# EAGLE design left (EAGLE 9.6.2)
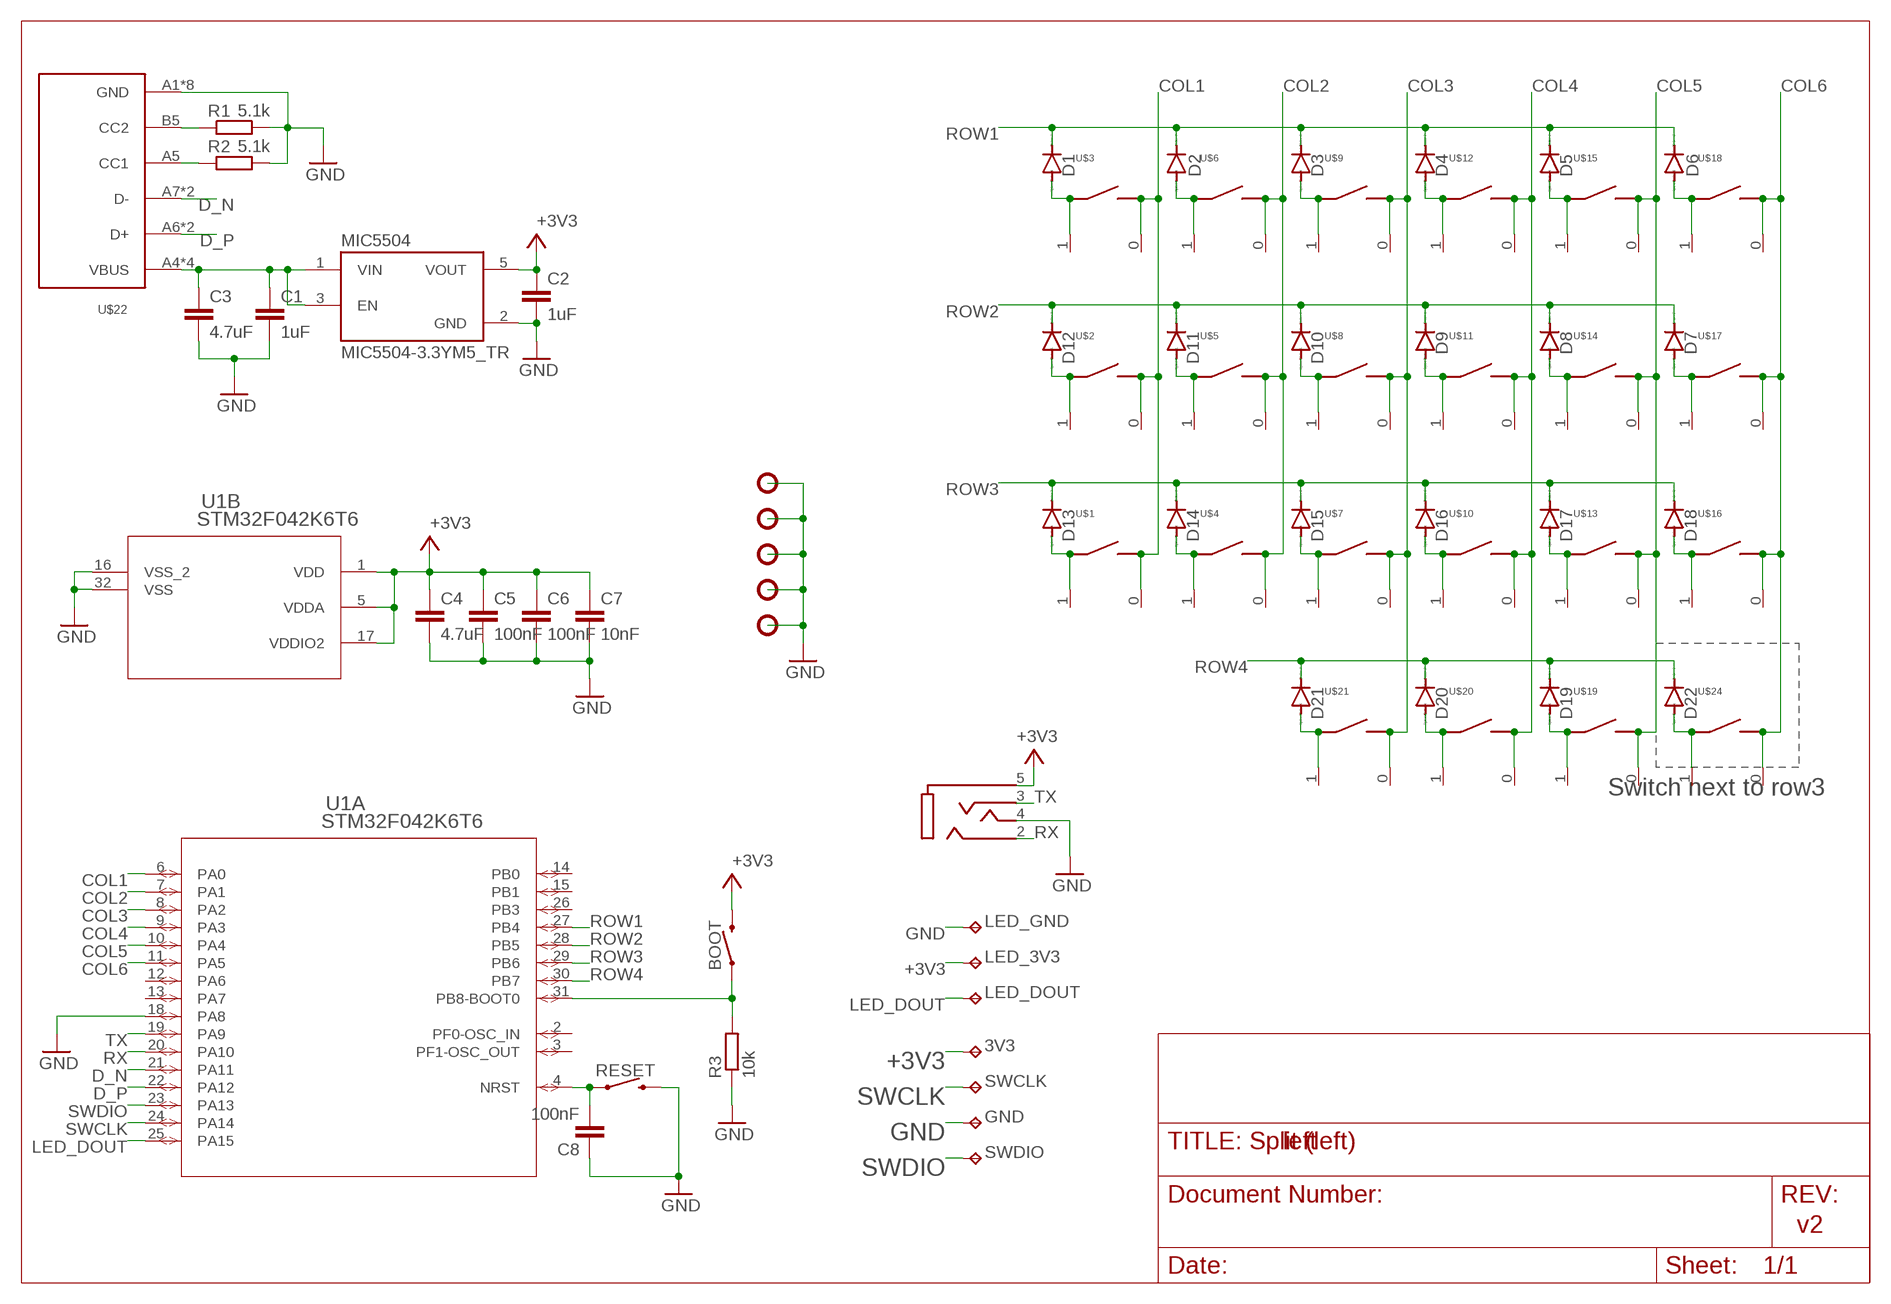
[diagram p0: schematic, sheet 1]

## Parts
3V3  TPTP20R  [TP20R]
BOOT  MOMENTARY-SWITCH-SPST-SMD-6.2MM-TALL  [TACTILE_SWITCH_SMD_6.2MM]
C1  1uF  C-EUC0603  [C0603]
C2  1uF  C-EUC0603  [C0603]
C3  4.7uF  C-EUC0603  [C0603]
C4  4.7uF  C-EUC0603  [C0603]
C5  100nF  C-EUC0603  [C0603]
C6  100nF  C-EUC0603  [C0603]
C7  10nF  C-EUC0603  [C0603]
C8  100nF  C-EUC0603  [C0603]
D1  DIODE-MINIMELF  [MINIMELF]
D2  DIODE-MINIMELF  [MINIMELF]
D3  DIODE-MINIMELF  [MINIMELF]
D4  DIODE-MINIMELF  [MINIMELF]
D5  DIODE-MINIMELF  [MINIMELF]
D6  DIODE-MINIMELF  [MINIMELF]
D7  DIODE-MINIMELF  [MINIMELF]
D8  DIODE-MINIMELF  [MINIMELF]
D9  DIODE-MINIMELF  [MINIMELF]
D10  DIODE-MINIMELF  [MINIMELF]
D11  DIODE-MINIMELF  [MINIMELF]
D12  DIODE-MINIMELF  [MINIMELF]
D13  DIODE-MINIMELF  [MINIMELF]
D14  DIODE-MINIMELF  [MINIMELF]
D15  DIODE-MINIMELF  [MINIMELF]
D16  DIODE-MINIMELF  [MINIMELF]
D17  DIODE-MINIMELF  [MINIMELF]
D18  DIODE-MINIMELF  [MINIMELF]
D19  DIODE-MINIMELF  [MINIMELF]
D20  DIODE-MINIMELF  [MINIMELF]
D21  DIODE-MINIMELF  [MINIMELF]
D22  DIODE-MINIMELF  [MINIMELF]
GND  TPTP20R  [TP20R]
LED_3V3  TPTP20R  [TP20R]
LED_DOUT  TPTP20R  [TP20R]
LED_GND  TPTP20R  [TP20R]
MIC5504  MIC5504-3.3YM5_TR  [SOT95P280X145-5N]
R1  5.1k  R-EU_R0603  [R0603]
R2  5.1k  R-EU_R0603  [R0603]
R3  10k  R-EU_R0603  [R0603]
RESET  MOMENTARY-SWITCH-SPST-SMD-6.2MM-TALL  [TACTILE_SWITCH_SMD_6.2MM]
SWCLK  TPTP20R  [TP20R]
SWDIO  TPTP20R  [TP20R]
U1  STM32F042K6T6  [LQFP-32]
U$1  CHOC-CHOC-1U  [CHOC-1U]
U$2  CHOC-CHOC-1U  [CHOC-1U]
U$3  CHOC-CHOC-1U  [CHOC-1U]
U$4  CHOC-CHOC-1U  [CHOC-1U]
U$5  CHOC-CHOC-1U  [CHOC-1U]
U$6  CHOC-CHOC-1U  [CHOC-1U]
U$7  CHOC-CHOC-1U  [CHOC-1U]
U$8  CHOC-CHOC-1U  [CHOC-1U]
U$9  CHOC-CHOC-1U  [CHOC-1U]
U$10  CHOC-CHOC-1U  [CHOC-1U]
U$11  CHOC-CHOC-1U  [CHOC-1U]
U$12  CHOC-CHOC-1U  [CHOC-1U]
U$13  CHOC-CHOC-1U  [CHOC-1U]
U$14  CHOC-CHOC-1U  [CHOC-1U]
U$15  CHOC-CHOC-1U  [CHOC-1U]
U$16  CHOC-CHOC-1U  [CHOC-1U]
U$17  CHOC-CHOC-1U  [CHOC-1U]
U$18  CHOC-CHOC-1U  [CHOC-1U]
U$19  CHOC-CHOC-1U  [CHOC-1U]
U$20  CHOC-CHOC-1U  [CHOC-1U]
U$21  CHOC-CHOC-1U  [CHOC-1U]
U$22  217B-AG01  [217B-AG01]
U$23  PJ320A  [PJ320A]
U$24  CHOC-CHOC-1U  [CHOC-1U]
U$25  SOCKET  [CHOC-SOCKET]
U$26  SOCKET  [CHOC-SOCKET]
U$27  SOCKET  [CHOC-SOCKET]
U$28  SOCKET  [CHOC-SOCKET]
U$29  SOCKET  [CHOC-SOCKET]
U$30  SOCKET  [CHOC-SOCKET]
U$31  SOCKET  [CHOC-SOCKET]
U$32  SOCKET  [CHOC-SOCKET]
U$33  SOCKET  [CHOC-SOCKET]
U$34  SOCKET  [CHOC-SOCKET]
U$35  SOCKET  [CHOC-SOCKET]
U$36  SOCKET  [CHOC-SOCKET]
U$37  SOCKET  [CHOC-SOCKET]
U$38  SOCKET  [CHOC-SOCKET]
U$39  SOCKET  [CHOC-SOCKET]
U$40  SOCKET  [CHOC-SOCKET]
U$41  SOCKET  [CHOC-SOCKET]
U$42  SOCKET  [CHOC-SOCKET]
U$43  SOCKET  [CHOC-SOCKET]
U$44  SOCKET  [CHOC-SOCKET]
U$45  SOCKET  [CHOC-SOCKET]
U$46  SOCKET  [CHOC-SOCKET]
U$47  MOUNTING-PADHOLE-M2-OFFSET  [HOLE-M2-OFFSET]
U$48  MOUNTING-PADHOLE-M2-OFFSET  [HOLE-M2-OFFSET]
U$49  MOUNTING-PADHOLE-M2-OFFSET  [HOLE-M2-OFFSET]
U$50  MOUNTING-PADHOLE-M2-OFFSET  [HOLE-M2-OFFSET]
U$51  MOUNTING-PADHOLE-M2-OFFSET  [HOLE-M2-OFFSET]

## Nets
+3V3: 3V3.TP BOOT.B2 C2.1 C4.1 C5.1 C6.1 C7.1 LED_3V3.TP MIC5504.5(VOUT) U1.1(B:VDD) U1.5(B:VDDA) U1.17(B:VDDIO2) U$23.5
COL1: U1.6(A:PA0) U$1.1 U$2.1 U$3.1 U$25.0 U$30.0 U$41.0
COL2: U1.7(A:PA1) U$4.1 U$5.1 U$6.1 U$26.0 U$31.0 U$42.0
COL3: U1.8(A:PA2) U$7.1 U$8.1 U$9.1 U$21.1 U$27.0 U$32.0 U$37.0 U$43.0
COL4: U1.9(A:PA3) U$10.1 U$11.1 U$12.1 U$20.1 U$28.0 U$33.0 U$38.0 U$44.0
COL5: U1.10(A:PA4) U$13.1 U$14.1 U$15.1 U$19.1 U$29.0 U$34.0 U$39.0 U$45.0
COL6: U1.11(A:PA5) U$16.1 U$17.1 U$18.1 U$24.1 U$35.0 U$36.0 U$40.0 U$46.0
D_N: U1.21(A:PA11) U$22.A7(D-) U$22.B7(D-)
D_P: U1.22(A:PA12) U$22.A6(D+) U$22.B6(D+)
GND: C1.2 C2.2 C3.2 C4.2 C5.2 C6.2 C7.2 C8.1 GND.TP LED_GND.TP MIC5504.2(GND) R1.2 R2.2 R3.1 RESET.B2 U1.16(B:VSS_2) U1.18(A:PA8) U1.32(B:VSS) U$22.A1(GND) U$22.A12(GND) U$22.B1(GND) U$22.B12(GND) U$22.SHELL1(GND) U$22.SHELL2(GND) U$22.SHELL3(GND) U$22.SHELL(GND) U$23.4 U$47.P$1(P) U$48.P$1(P) U$49.P$1(P) U$50.P$1(P) U$51.P$1(P)
LED_DOUT: LED_DOUT.TP U1.25(A:PA15)
N$1: R2.1 U$22.A5(CC1)
N$2: R1.1 U$22.B5(CC2)
N$3: C1.1 C3.1 MIC5504.1(VIN) MIC5504.3(EN) U$22.A4(VBUS) U$22.A9(VBUS) U$22.B4(VBUS) U$22.B9(VBUS)
N$4: D1.A U$3.0 U$41.1
N$5: D2.A U$6.0 U$42.1
N$7: D12.A U$2.0 U$30.1
N$8: D11.A U$5.0 U$31.1
N$9: BOOT.A2 R3.2 U1.31(A:PB8-BOOT0)
N$10: C8.2 RESET.A2 U1.4(A:NRST)
N$11: D18.A U$16.0 U$36.1
N$12: D10.A U$8.0 U$32.1
N$13: D9.A U$11.0 U$33.1
N$14: D8.A U$14.0 U$34.1
N$15: D7.A U$17.0 U$35.1
N$16: D22.A U$24.0 U$40.1
N$17: D17.A U$13.0 U$29.1
N$18: D13.A U$1.0 U$25.1
N$19: D14.A U$4.0 U$26.1
N$20: D15.A U$7.0 U$27.1
N$21: D16.A U$10.0 U$28.1
N$22: D20.A U$20.0 U$38.1
N$23: D3.A U$9.0 U$43.1
N$24: D4.A U$12.0 U$44.1
N$25: D5.A U$15.0 U$45.1
N$26: D6.A U$18.0 U$46.1
N$27: D21.A U$21.0 U$37.1
N$28: D19.A U$19.0 U$39.1
ROW1: D1.C D2.C D3.C D4.C D5.C D6.C U1.27(A:PB4)
ROW2: D7.C D8.C D9.C D10.C D11.C D12.C U1.28(A:PB5)
ROW3: D13.C D14.C D15.C D16.C D17.C D18.C U1.29(A:PB6)
ROW4: D19.C D20.C D21.C D22.C U1.30(A:PB7)
RX: U1.20(A:PA10) U$23.2
SWCLK: SWCLK.TP U1.24(A:PA14)
SWDIO: SWDIO.TP U1.23(A:PA13)
TX: U1.19(A:PA9) U$23.3
Unconnected: U1.2(A:PF0-OSC_IN) U1.3(A:PF1-OSC_OUT) U1.12(A:PA6) U1.13(A:PA7) U1.14(A:PB0) U1.15(A:PB1) U1.26(A:PB3)

## Notes on the sheet
- Switch next to row3
- Split (left)
- v2

## Library data of the parts
3V3 GND LED_3V3 LED_DOUT LED_GND SWCLK SWDIO = testpad:TP: Test pad
BOOT RESET = PTS645SH50SMTR92LFS:MOMENTARY-SWITCH-SPST: PTS645SH50SMTR92LFS C&K SPST Pushbutton; PROD_ID: SWCH-11966; SF_SKU: COM-12992
C1-C8 = rcl:C-EU: CAPACITOR, European symbol; SPICEPREFIX: C
D1-D22 = diode:DIODE-: DIODE
MIC5504 = MIC5504-3.3YM5_TR:MIC5504-3.3YM5_TR: Linear Voltage Regulator IC 1 Output 300mA SOT-23-5; AVAILABILITY: Unavailable; DESCRIPTION: Linear Voltage Regulator IC 1 Output 300mA SOT-23-5; MF: Microchip; MP: MIC5504-3.3YM5 TR; PACKAGE: SOT-23 Microchip; PRICE: None
R1-R3 = rcl:R-EU_: RESISTOR, European symbol; SPICEPREFIX: R
U1 = STM32F042K6T6:STM32F042K6T6; BUILT_BY: EMA_UL_Team; COPYRIGHT: Copyright (C) 2018 Accelerated Designs. All rights reserved; MANUFACTURER_PART_NUMBER: STM32F042K6T6; SOURCELIBRARY: Updates_to_database_2020-10-19; VENDOR: STMicroelectronics
U$1-U$21 U$24 = choc:CHOC
U$22 = usbc:217B-AG01
U$23 = PJ320A:PJ320A
U$25-U$46 = choc:SOCKET
U$47-U$51 = platedhole:MOUNTING-PAD

## Board
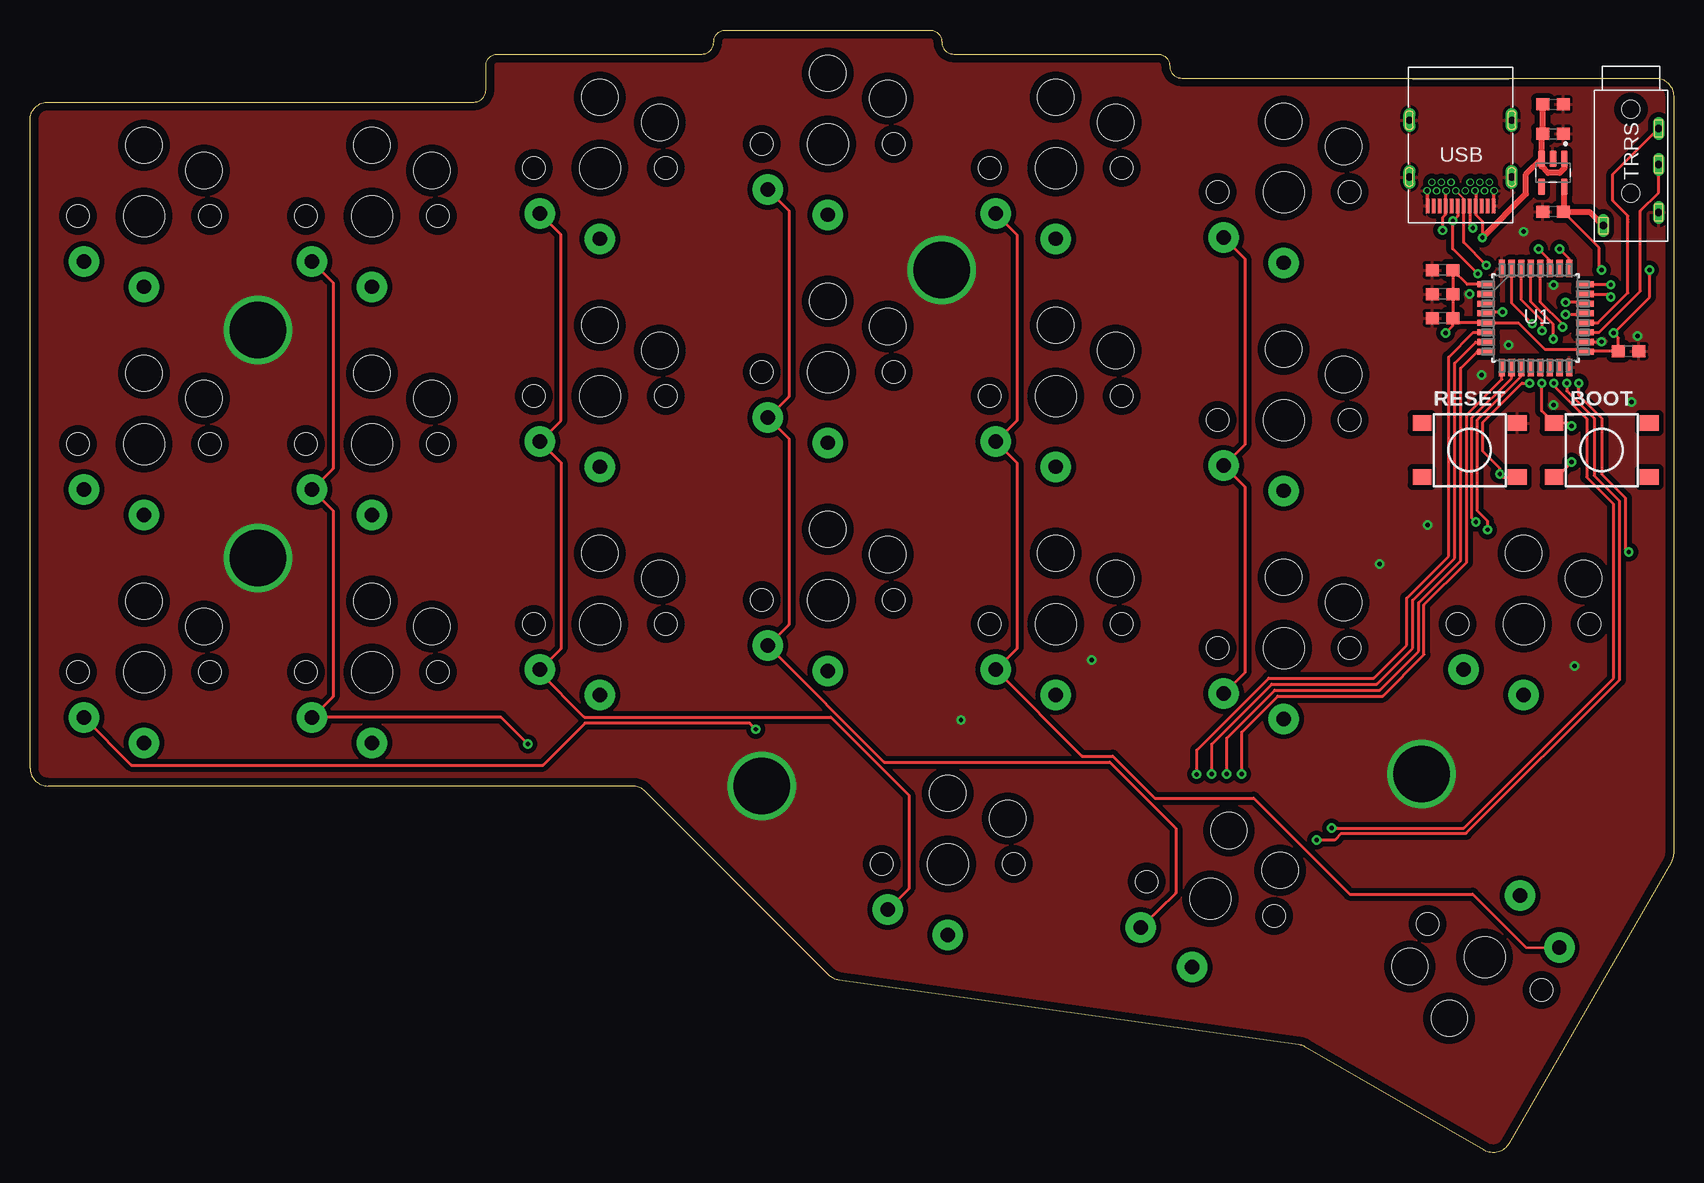
[diagram p1: board, top side]
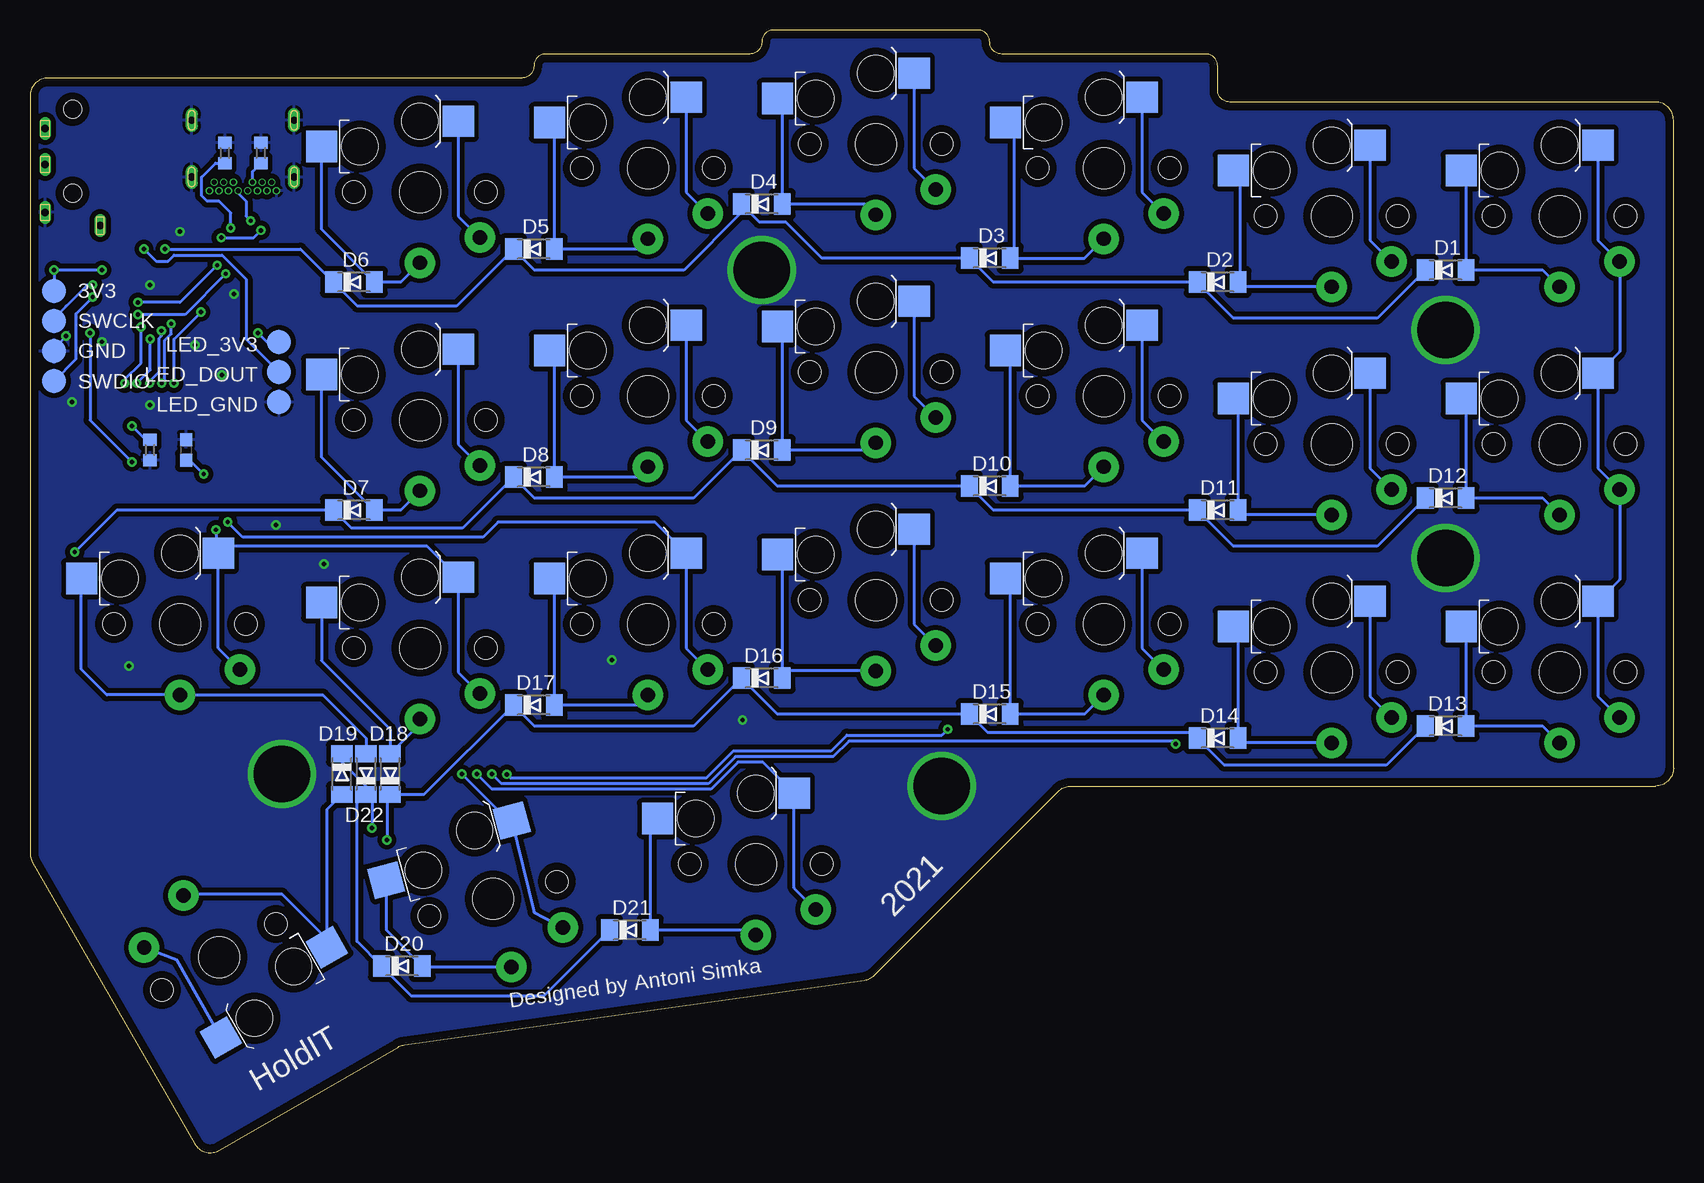
[diagram p2: board, bottom side, seen from below]

Size 137 x 93.56 mm. Coordinates in mm from the lower left corner, seen from the top.
Outline: 0,32.06 0,86.06 arc-90 1.5,87.56 37,87.56 arc90 38,88.56 38,90.56 arc-90 39,91.56 56,91.56 arc90 57,92.56 arc-90 58,93.56 75,93.56 arc-90 76,92.56 arc90 77,91.56 94,91.56 arc-90 95,90.56 arc90 96,89.56 135.5,89.56 arc-90 137,88.06 137,24.96 arc-30 136.8,24.21 123.27,0.75 arc-90 121.22,0.2 106.32,8.8 arc22 105.78,8.99 67.45,14.38 arc-37 66.59,14.8 51.28,30.12 arc45 50.22,30.56 1.5,30.56 arc-90 0,32.06
Copper layers (1*16): Top 0.035mm / dielectric 1.5mm / Bottom 0.035mm
Design rules "default *": minimum track width 6mil, minimum drill 10mil, track to track 8mil, track to pad 8mil, pad to pad 7mil, via to via 10mil, smd to smd 7mil, copper to edge 25mil, drill to drill 6mil, minimum pad ring 4mil, minimum via ring 8mil, stop-mask expansion 4mil, vias tented up to drill 0mil, thermal gap 10mil

### Footprints (pad centres in the part's own frame; a part is rotated, then mirrored left to right if it is on the bottom)
TP20R = smd 2 x 2: TP 0,0
TACTILE_SWITCH_SMD_6.2MM = smd 1.55 x 1.3: A1 -3.975,-2.25; A2 3.975,-2.25; B1 -3.975,2.25; B2 3.975,2.25
C0603 = smd 1.1 x 1: 1 -0.85,0; 2 0.85,0
MINIMELF = smd 1.4 x 1.8: A 1.7,0; C -1.7,0
SOT95P280X145-5N = smd 1.39 x 0.58: 1 -1.165,0.95; 2 -1.165,0; 3 -1.165,-0.95; 4 1.165,-0.95; 5 1.165,0.95
R0603 = smd 1 x 1.1: 1 -0.85,0; 2 0.85,0
LQFP-32 = smd 1.473 x 0.508: 1 -4.115,2.8; 2 -4.115,2; 3 -4.115,1.2; 4 -4.115,0.4; 5 -4.115,-0.4; 6 -4.115,-1.2; 7 -4.115,-2; 8 -4.115,-2.8; 17 4.115,-2.8; 18 4.115,-2; 19 4.115,-1.2; 20 4.115,-0.4; 21 4.115,0.4; 22 4.115,1.2; 23 4.115,2; 24 4.115,2.8 | smd 0.508 x 1.473: 9 -2.8,-4.115; 10 -2,-4.115; 11 -1.2,-4.115; 12 -0.4,-4.115; 13 0.4,-4.115; 14 1.2,-4.115; 15 2,-4.115; 16 2.8,-4.115; 25 2.8,4.115; 26 2,4.115; 27 1.2,4.115; 28 0.4,4.115; 29 -0.4,4.115; 30 -1.2,4.115; 31 -2,4.115; 32 -2.8,4.115
CHOC-1U = drill 1.2 pad 2.54: 0 0,5.9; 1 5,3.8 | hole 3.4: 0,0 | hole 1.85: -5.5,0; 5.5,0
217B-AG01 = smd 0.3 x 1.2: A1 2.75,0.6; A2 2.25,0.6; A3 1.75,0.6; A4 1.25,0.6; A5 0.75,0.6; A6 0.25,0.6; A7 -0.25,0.6; A8 -0.75,0.6; A9 -1.25,0.6; A10 -1.75,0.6; A11 -2.25,0.6; A12 -2.75,0.6 | drill 0.4 pad 0.55: B1 -2.8,1.855; B2 -2.4,2.555; B3 -1.6,2.555; B4 -1.2,1.855; B5 -0.8,2.555; B6 -0.4,1.855; B7 0.4,1.855; B8 0.8,2.555; B9 1.2,1.855; B10 1.6,2.555; B11 2.4,2.555; B12 2.8,1.855; MID -2,1.855; MID1 2,1.855 | drill 0.6 pad 1 long: SHELL -4.27,3; SHELL1 -4.27,7.73; SHELL2 4.27,7.73; SHELL3 4.27,3
PJ320A = drill 0.65 long: 2 -0.75,-3.2; 3 -0.75,-6.2; 4 -0.75,-10.2; 5 -5.35,-11.3 | hole 1.5: -3.05,-1.6; -3.05,-8.6
CHOC-SOCKET = smd 2.6 x 2.6: 0 -3.2,-5.9; 1 8.2,-3.8 | hole 3: 0,-5.9; 5,-3.8
HOLE-M2-OFFSET = drill 4.7: P$1 0,0

### Placement (x,y rotation side)
3V3  135,71.81 0 bottom
BOOT  131,58.56 180 top
C1  126.95,84.91 0 top
C2  126.95,78.41 180 top
C3  126.95,87.36 0 top
C4  117.75,71.56 180 top
C5  117.75,73.56 180 top
C6  133.25,66.81 0 top
C7  117.75,69.56 180 top
C8  124,58.56 270 bottom
D1  19,73.56 0 bottom
D2  38,72.56 0 bottom
D3  57,74.56 0 bottom
D4  76,79.06 0 bottom
D5  95,75.31 0 bottom
D6  110,72.56 0 bottom
D7  110,53.56 0 bottom
D8  95,56.31 0 bottom
D9  76,58.56 0 bottom
D10  57,55.56 0 bottom
D11  38,53.56 0 bottom
D12  19,54.56 0 bottom
D13  19,35.56 0 bottom
D14  38,34.56 0 bottom
D15  57,36.56 0 bottom
D16  76,39.56 0 bottom
D17  95,37.31 0 bottom
D18  107,31.56 90 bottom
D19  111,31.56 270 bottom
D20  106,15.56 0 bottom
D21  87,18.56 0 bottom
D22  109,31.56 90 bottom
GND  135,66.81 0 bottom
LED_3V3  116.25,67.56 0 bottom
LED_DOUT  116.25,65.06 0 bottom
LED_GND  116.25,62.56 0 bottom
MIC5504  126.95,81.66 270 top
R1  117.75,83.31 90 bottom
R2  120.75,83.31 90 bottom
R3  127,58.56 90 bottom
RESET  120,58.56 0 top
SWCLK  135,69.31 0 bottom
SWDIO  135,64.31 0 bottom
U1  125.5,69.56 0 top
U$1  9.5,40.06 180 top
U$2  9.5,59.06 180 top
U$3  9.5,78.06 180 top
U$4  28.5,40.06 180 top
U$5  28.5,59.06 180 top
U$6  28.5,78.06 180 top
U$7  47.5,44.06 180 top
U$8  47.5,63.06 180 top
U$9  47.5,82.06 180 top
U$10  66.5,46.06 180 top
U$11  66.5,65.06 180 top
U$12  66.5,84.06 180 top
U$13  85.5,44.06 180 top
U$14  85.5,63.06 180 top
U$15  85.5,82.06 180 top
U$16  104.5,42.06 180 top
U$17  104.5,61.06 180 top
U$18  104.5,80.06 180 top
U$19  121.25,16.31 330 top
U$20  98.4,21.16 165 top
U$21  76.5,24.06 180 top
U$22  119.25,78.31 0 top
U$23  136.5,88.56 0 top
U$24  124.5,44.06 180 top
U$25  9.5,40.06 180 bottom
U$26  28.5,40.06 180 bottom
U$27  47.5,44.06 180 bottom
U$28  66.5,46.06 180 bottom
U$29  85.5,44.06 180 bottom
U$30  9.5,59.06 180 bottom
U$31  28.5,59.06 180 bottom
U$32  47.5,63.06 180 bottom
U$33  66.5,65.06 180 bottom
U$34  85.5,63.06 180 bottom
U$35  104.5,61.06 180 bottom
U$36  104.5,42.06 180 bottom
U$37  76.5,24.06 180 bottom
U$38  98.4,21.16 195 bottom
U$39  121.25,16.31 30 bottom
U$40  124.5,44.06 180 bottom
U$41  9.5,78.06 180 bottom
U$42  28.5,78.06 180 bottom
U$43  47.5,82.06 180 bottom
U$44  66.5,84.06 180 bottom
U$45  85.5,82.06 180 bottom
U$46  104.5,80.06 180 bottom
U$47  19,68.56 0 top
U$48  19,49.56 0 top
U$49  61,30.56 0 top
U$50  116,31.56 0 top
U$51  76,73.56 0 top

### Tracks (layer width: path | path; a pad name or v marks a point on that pad's centre or on a via)
+3V3  (via drill 0.35)
  Top 0.254: C7.1 119,69.16 U1.5 124.08,69.16 126.26,66.97 129.4,66.97 U1.17 129.66,66.81 C6.1 132.4,67.91 v132,68.31 135,71.31 v135,73.56 | U1.1 119.8,72.36 C5.1 C4.1 C7.1 | v131,73.56 130.8,73.76 130.8,75.41 C2.1 | BOOT.B2 127.25,56.31 v128.5,57.56 | v118,68.31 118.6,68.91 C7.1
  Top 0.508: MIC5504.5 127.9,78.51 C2.1 130,78.41 U$23.5
  Bottom 0.254: v132,68.31 132,61.06 v128.5,57.56 | v131,73.56 v135,73.56 3V3.TP | LED_3V3.TP 117.25,67.56 v118,68.31
COL1  (via drill 0.35)
  Top 0.254: v60.5,35.3 59.99,35.81 46.25,35.81 42.75,32.31 8.45,32.31 U$1.1 | v97.25,31.52 97.25,33.56 103.25,39.56 112,39.56 114.75,42.31 114.75,46.2 118.25,49.7 118.25,66.31 120.3,68.36 U1.6
  Bottom 0.254: U$41.0 6.3,76.06 U$3.1 4.5,66.76 U$30.0 6.3,57.06 U$2.1 4.5,47.76 U$25.0 6.3,38.06 U$1.1 | v60.5,35.3 61,34.8 68.91,34.8 70.23,33.47 78.38,33.47 80.63,31.22 96.95,31.22 v97.25,31.52
COL2  (via drill 0.35)
  Top 0.254: U$6.1 25.25,72.51 25.25,57.01 U$5.1 25.25,53.51 25.25,38.01 U$4.1 23.55,36.31 39.25,36.31 v41.5,34.06 | v98.5,31.56 98.5,34.06 103.5,39.06 112.25,39.06 115.25,42.06 115.25,46.06 118.75,49.56 118.75,65.81 120.5,67.56 U1.7
  Bottom 0.254: U$42.0 25.3,76.06 U$6.1 | U$31.0 25.3,57.06 U$5.1 | U$26.0 25.3,38.06 U$4.1 | v41.5,34.06 41.75,34.31 68.75,34.31 70.04,33.01 78.19,33.01 80.44,30.76 97.71,30.76 v98.5,31.56
COL3  (via drill 0.35)
  Top 0.254: U$9.1 44.25,76.51 44.25,61.01 U$8.1 44.25,57.51 44.25,42.01 U$7.1 42.5,40.01 46.2,36.31 66.75,36.31 73.25,29.81 73.25,22.01 U$21.1 | v99.75,31.56 99.75,34.56 103.75,38.56 112.5,38.56 115.75,41.81 115.75,45.84 119.25,49.34 119.25,65.37 120.64,66.76 U1.8
  Bottom 0.254: U$43.0 44.3,80.06 U$9.1 | U$32.0 44.3,61.06 U$8.1 | U$27.0 44.3,42.06 U$7.1 | U$21.1 73.3,22.06 U$37.0 75.9,32.56 78,32.56 80.25,30.31 98.5,30.31 v99.75,31.56
COL4  (via drill 0.35)
  Top 0.254: U$12.1 63.25,78.51 63.25,63.01 U$11.1 63.25,59.51 63.25,44.01 U$10.1 71.2,32.56 90,32.56 95.5,27.06 95.5,21.64 U$20.1 | v101,31.56 101,35.06 104,38.06 112.75,38.06 116.21,41.51 116.21,45.65 119.75,49.19 119.75,61.49 122.7,64.44 U1.9
  Bottom 0.254: U$44.0 63.3,82.06 U$12.1 | U$33.0 63.3,63.06 U$11.1 | U$28.0 63.3,44.06 U$10.1 | U$20.1 95,20.06 U$38.0 97.13,27.68 v101,31.56
COL5  (via drill 0.35)
  Top 0.254: U$15.1 82.25,76.51 82.25,61.01 U$14.1 82.25,57.51 82.25,42.01 U$13.1 87.7,33.06 90.25,33.06 93.75,29.56 102,29.56 110,21.56 120.25,21.56 124.7,17.11 U$19.1 | U1.10 123.5,64.56 120.21,61.26 120.21,52.86 v120.51,52.56
  Bottom 0.254: U$45.0 82.3,80.06 U$15.1 | U$34.0 82.3,61.06 U$14.1 | U$13.1 82.3,42.06 U$29.0 84.9,52.56 98,52.56 99.25,51.31 119.26,51.31 v120.51,52.56 | U$39.0 124.75,16.06 U$19.1
COL6  (via drill 0.35)
  Top 0.254: U$18.1 101.25,74.51 101.25,59.01 U$17.1 101.25,55.51 101.25,40.01 U$16.1 | U1.11 124.3,64.71 120.66,61.07 120.66,53.47 121.5,52.64 v121.5,51.91
  Bottom 0.254: U$35.0 101.3,59.06 U$17.1 | U$46.0 101.3,78.06 U$18.1 | U$16.1 101.3,40.06 U$36.0 103.9,50.56 120.7,50.56 U$40.0 | U$24.1 121.3,42.06 U$40.0 | v121.5,51.91 121.5,50.16 U$40.0
D_N  (via drill 0.35)
  Top 0.254: U$22.A7 119,78.06 v118.6,77.66 118.6,75.32 v120.68,73.24 | U1.21 129.5,69.85 v128,69.85
  Bottom 0.254: U$22.B7 119.65,79.96 119,79.31 119,78.06 v118.6,77.66 | v128,69.85 124.07,69.85 v120.68,73.24
D_P  (via drill 0.35)
  Top 0.152: U$22.B6 119.5,79.51 U$22.A6
  Top 0.254: v121.4,73.95 119.5,75.85 U$22.A6 | U1.22 129.51,70.86 v128,70.86
  Bottom 0.254: v128,70.86 124.49,70.86 v121.4,73.95
GND  (via drill 0.35)
  Top 0.254: U$22.A1 122,80.11 U$22.B12 | U$22.A12 116.5,80.11 U$22.B1 | U1.18 129.62,67.57 v131,67.57
  Bottom 0.254: v134,68.06 135,67.06 GND.TP
  other vias: 133.5,62.56 123.25,67.31 121,64.81 120,71.56 128.75,40.56 88.5,41.06 112.5,49.06 116.5,52.31 124.5,76.76 77.6,36.06 127,62.31 127,72.31
  pour Bottom (isolate 0.406): -2,94.56 -2,-0.44 arc90 0,-2.44 138,-2.44 arc90 139,-1.44 139,94.56 arc90 138,95.56 -1,95.56 arc90
  pour Top (isolate 0.406): -3,95.56 -3,-2.44 arc90 -2,-3.44 139,-3.44 arc90 140,-2.44 140,95.56 arc90 139,96.56 -2,96.56 arc90
LED_DOUT  (via drill 0.35)
  Top 0.254: U1.25 128.3,74.51 v127.5,75.31
  Bottom 0.254: LED_DOUT.TP 119,67.81 119,72.81 121,74.81 125,74.81 125.5,74.31 126.5,74.31 v127.5,75.31
N$1  (via drill 0.35)
  Top 0.254: U$22.A5 120,77.32 v120.26,77.06
  Bottom 0.254: v120.26,77.06 120.26,78.32 121.25,79.31 122.25,79.31 122.69,79.75 122.69,81.31 121.54,82.46 R2.1
N$2
  Bottom 0.254: U$22.B5 118.45,81.76 R1.1
N$3  (via drill 0.35)
  Top 0.254: U$22.B9 120.5,80.11 U$22.A4 120.52,78.89 120.52,78.17 121.05,77.64 v121.05,76.26 | U$22.B4 118,80.11 U$22.A9 117.98,78.89 117.98,78.17 117.75,77.94 v117.75,76.86
  Top 0.508: v121.05,76.26 124.7,79.91 124.7,81.52 MIC5504.3 | MIC5504.3 126,84.81 C1.1 C3.1 | MIC5504.1 127.9,82.06 127.5,81.66 126.53,81.66 126,82.18 MIC5504.3
  Bottom 0.254: v121.05,76.26 118.35,76.26 v117.75,76.86
N$4
  Bottom 0.254: U$41.1 17.3,81.46 D1.A 10.9,73.56 U$3.0
N$5
  Bottom 0.254: U$6.0 35.9,72.16 36.15,72.41 | 36.15,72.41 D2.A | U$42.1 36.15,81.31 36.15,72.41
N$7
  Bottom 0.254: U$2.0 10.9,54.56 D12.A 17.3,62.46 U$30.1
N$8
  Bottom 0.254: U$31.1 36.3,62.46 D11.A 35.9,53.16 U$5.0
N$9  (via drill 0.35)
  Top 0.254: v128.5,60.56 128.25,60.81 BOOT.A2 126.01,61.82 v126.01,64.12 | v125.22,69.09 123.5,70.81 U1.31
  Bottom 0.254: R3.2 127.35,59.41 v128.5,60.56 | v126.01,64.12 125.76,64.37 125.76,67.69 125.22,68.23 v125.22,69.09
N$10  (via drill 0.35)
  Top 0.254: RESET.A2 122.78,56.31 v122.53,56.56 122.53,57.03 121.12,58.43 121.12,60.88 124.36,64.12 v125,64.12 | v122.75,70.06 121.48,70.06 U1.4
  Bottom 0.254: C8.2 123.68,57.71 v122.53,56.56 | v125,64.12 125,67.81 v122.75,70.06
N$11
  Bottom 0.254: U$16.0 104.5,35.76 D18.A 107,35.31 112.7,41.01 U$36.1
N$12
  Bottom 0.254: U$32.1 55.3,66.46 D10.A 49.1,55.56 U$8.0
N$13
  Bottom 0.254: U$33.1 74.3,68.46 D9.A 67.1,58.56 U$11.0
N$14
  Bottom 0.254: U$34.1 93.3,66.46 D8.A 86.35,56.31 U$14.0
N$15
  Bottom 0.254: U$17.0 106.1,53.56 D7.A 112.7,57.96 U$35.1
N$16
  Bottom 0.254: D22.A 109,34.56 112.6,38.16 U$24.0 130.6,38.16 132.75,40.31 132.75,47.81 U$40.1
N$17
  Bottom 0.254: U$29.1 93.3,47.46 D17.A 86.35,37.31 U$13.0
N$18
  Bottom 0.254: U$25.1 17.3,43.46 D13.A 10.9,35.56 U$1.0
N$19
  Bottom 0.254: U$26.1 36.3,43.46 D14.A 35.9,34.16 U$4.0
N$20
  Bottom 0.254: U$27.1 55.3,47.46 D15.A 49.1,36.56 U$7.0
N$21
  Bottom 0.254: U$28.1 74.3,49.46 D16.A 73.7,40.16 U$10.0
N$22
  Bottom 0.254: U$38.1 107.3,18.56 D20.A 104.2,15.46 U$20.0
N$23
  Bottom 0.254: D3.A 55,74.56 | 55,74.56 49.1,74.56 U$9.0 | U$43.1 55,85.16 55,74.56
N$24
  Bottom 0.254: U$12.0 67.4,79.06 D4.A 74.3,87.46 U$44.1
N$25
  Bottom 0.254: U$45.1 93.3,85.46 D5.A 86.35,75.31 U$15.0
N$26
  Bottom 0.254: U$46.1 112.7,76.96 D6.A 106.1,72.56 U$18.0
N$27
  Bottom 0.254: U$37.1 85.3,27.26 D21.A 76.9,18.56 U$21.0
N$28
  Bottom 0.254: U$19.0 124.06,21.56 116,21.56 112.25,17.81 U$39.1 112.25,28.61 D19.A
ROW1  (via drill 0.35)
  Top 0.254: v125.75,75.31 126.7,74.36 U1.27
  Bottom 0.254: D1.C 24.7,69.56 36.7,69.56 D2.C 56.7,72.56 D3.C 71,74.56 74,77.56 76.2,77.56 D4.C 77.7,78.36 82.5,73.56 94.95,73.56 D5.C 101.45,70.56 109.7,70.56 D6.C 114.45,75.31 v125.75,75.31
ROW2  (via drill 0.35)
  Top 0.254: v133.26,50.06 133,50.32 133,54.56 131,56.56 131,61.22 129.1,63.12 v129.1,64.12 | v127.75,68.81 127.75,69.02 125.9,70.87 U1.28
  Bottom 0.254: D12.C 24.7,50.56 36.7,50.56 D11.C 56.7,53.56 D10.C 74.7,55.56 D9.C 81.7,54.56 94.95,54.56 D8.C 100.95,52.06 110.2,52.06 D7.C 129.76,53.56 v133.26,50.06 | v129.1,64.12 129.1,64.45 127.75,65.81 v127.75,68.81
ROW3  (via drill 0.35)
  Top 0.254: U1.29 125.1,70.93 126.98,69.05 v126.98,67.81 | v128.09,64.12 128.09,63.48 130.38,61.2 130.38,56.43 132.5,54.31 132.5,39.41 119.69,26.6 109.29,26.6 108.75,26.06 v107.25,26.06
  Bottom 0.254: D13.C 23.95,32.31 37.45,32.31 D14.C 40.2,35.06 57.2,35.06 D15.C 74.7,36.56 D16.C 81.7,35.56 94.95,35.56 D17.C 104.15,29.86 D18.C 107.25,29.61 v107.25,26.06 | v126.98,67.81 126.98,65.24 v128.09,64.12
ROW4  (via drill 0.35)
  Top 0.254: v108.5,27.06 119.5,27.06 132,39.56 132,54.06 129.75,56.31 129.75,61.18 129.5,61.43 129.19,61.74 127.02,63.91 v127.02,64.12 | v126.04,68.48 126.04,69.34 124.3,71.08 U1.30
  Bottom 0.254: D21.C 94.2,13.06 105.2,13.06 D20.C 109.75,17.61 109.75,29.11 D22.C | D22.C 109,30.56 111,32.56 D19.C | D22.C 108.5,29.36 v108.5,27.06 | v127.02,64.12 127.02,64.29 126.22,65.09 126.22,67.88 126.04,68.06 v126.04,68.48
RX
  Top 0.254: U1.20 130.7,69.16 133.2,71.66 133.2,77.56 133.2,77.76 133.2,78.07 131.94,79.33 131.94,81.54 U$23.2
SWCLK  (via drill 0.35)
  Top 0.254: U1.24 131.72,72.36 v131.76,72.32
  Bottom 0.254: v131.76,72.32 v131.77,72.31 132.25,72.31 134,70.56 135,69.56 SWCLK.TP
SWDIO  (via drill 0.35)
  Top 0.254: U1.23 131.51,71.56 v131.76,71.31
  Bottom 0.254: SWDIO.TP 133.15,66.16 133.15,69.92 v131.76,71.31
TX
  Top 0.254: U1.19 130.8,68.36 134.24,71.8 134.24,78.49 135.75,80 U$23.3

### Text on the board
bPlace: 2021 | Designed by Antoni Simka | HoldIT
tNames: USB | TRRS